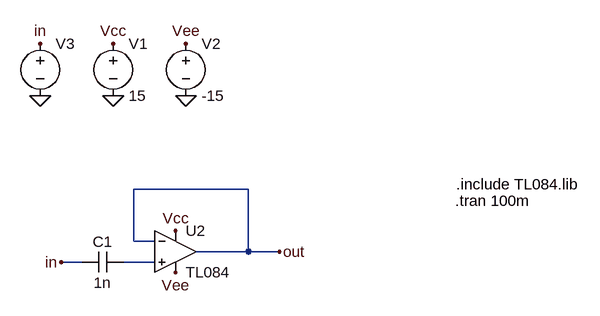
[diagram p0: schematic followerCapa.asc]
followerCapa.asc, the LTspice schematic file:
Version 4
SHEET 1 880 680
WIRE -48 176 -224 176
WIRE -224 256 -224 176
WIRE -192 256 -224 256
WIRE -48 272 -48 176
WIRE -48 272 -128 272
WIRE 0 272 -48 272
WIRE -304 288 -336 288
WIRE -192 288 -240 288
FLAG -256 32 0
FLAG -144 32 0
FLAG -256 -48 Vcc
FLAG -144 -48 Vee
FLAG -368 32 0
FLAG -368 -48 in
FLAG -160 240 Vcc
FLAG -160 304 Vee
FLAG 0 272 out
FLAG -336 288 in
SYMBOL voltage -256 -64 R0
WINDOW 123 0 0 Left 0
WINDOW 39 0 0 Left 0
SYMATTR InstName V1
SYMATTR Value 15
SYMBOL voltage -144 -64 R0
WINDOW 123 0 0 Left 0
WINDOW 39 0 0 Left 0
SYMATTR InstName V2
SYMATTR Value -15
SYMBOL voltage -368 -64 R0
WINDOW 3 24 96 Invisible 2
WINDOW 123 0 0 Left 0
WINDOW 39 0 0 Left 0
SYMATTR Value SINE(1 1 1k)
SYMATTR InstName V3
SYMBOL Opamps\\opamp2 -160 208 R0
SYMATTR InstName U2
SYMATTR Value TL084
SYMBOL cap -304 272 M90
WINDOW 0 0 32 VBottom 2
WINDOW 3 32 32 VTop 2
SYMATTR InstName C1
SYMATTR Value 1n
TEXT 272 168 Left 2 !.include TL084.lib
TEXT 270 194 Left 2 !.tran 100m

The netlist it stands for:
* followerCapa.asc
V1 Vcc 0 15
V2 Vee 0 -15
V3 in 0 SINE(1 1 1k)
XU2 N001 out Vcc Vee out TL084  ; pins In+ In- V+ V- OUT
C1 in N001 1n
.include TL084.lib
.tran 100m
.backanno
.end